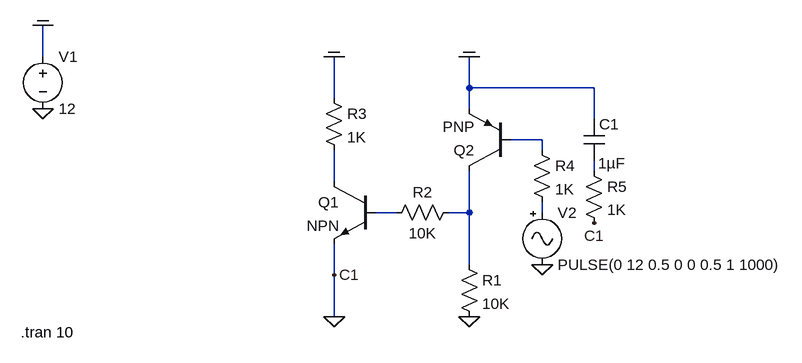
[diagram p0: schematic Draft1.asc]
Draft1.asc, the LTspice schematic file:
Version 4
SHEET 1 880 680
WIRE -512 -240 -512 -288
WIRE 144 -192 144 -240
WIRE 336 -192 144 -192
WIRE -64 -176 -64 -240
WIRE 144 -160 144 -192
WIRE 336 -144 336 -192
WIRE 256 -112 208 -112
WIRE 256 -96 256 -112
WIRE 336 -64 336 -80
WIRE -64 -48 -64 -96
WIRE 32 0 0 0
WIRE 144 0 144 -64
WIRE 144 0 112 0
WIRE 256 0 256 -16
WIRE 144 80 144 0
WIRE -64 96 -64 48
WIRE -64 160 -64 96
FLAG -64 160 0
FLAG -512 -288 COM
FLAG -64 -240 COM
FLAG 144 -240 COM
FLAG -512 -160 0
FLAG 144 160 0
FLAG -64 96 C1
FLAG 336 16 C1
FLAG 256 80 0
SYMBOL npn 0 -48 M0
SYMATTR InstName Q1
SYMBOL pnp 208 -64 R180
SYMATTR InstName Q2
SYMBOL res 128 64 R0
SYMATTR InstName R1
SYMATTR Value 10K
SYMBOL res 128 -16 R90
WINDOW 0 0 56 VBottom 2
WINDOW 3 32 56 VTop 2
SYMATTR InstName R2
SYMATTR Value 10K
SYMBOL res -80 -192 R0
SYMATTR InstName R3
SYMATTR Value 1K
SYMBOL voltage -512 -256 R0
WINDOW 123 0 0 Left 0
WINDOW 39 0 0 Left 0
SYMATTR InstName V1
SYMATTR Value 12
SYMBOL Misc\\signal 256 -16 R0
WINDOW 123 0 0 Left 0
WINDOW 39 0 0 Left 0
SYMATTR InstName V2
SYMATTR Value PULSE(0 12 0.5 0 0 0.5 1 1000)
SYMBOL res 240 -112 R0
SYMATTR InstName R4
SYMATTR Value 1K
SYMBOL cap 320 -144 R0
WINDOW 3 22 68 Left 2
SYMATTR InstName C1
SYMATTR Value 1µF
SYMBOL res 320 -80 R0
SYMATTR InstName R5
SYMATTR Value 1K
TEXT -546 184 Left 2 !.tran 10

The netlist it stands for:
* Draft1.asc
Q1 N003 N004 0 0 NPN
Q2 N005 N001 COM 0 PNP
R1 N005 0 10K
R2 N005 N004 10K
R3 COM N003 1K
V1 COM 0 12
V2 N006 0 PULSE(0 12 0.5 0 0 0.5 1 1000)
R4 N001 N006 1K
C1 COM N002 1µF
R5 N002 0 1K
.model NPN NPN
.model PNP PNP
.lib standard.bjt
.tran 10
.backanno
.end